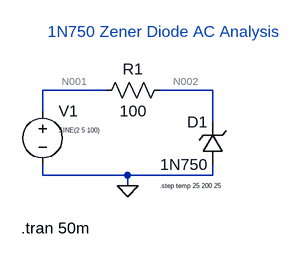
[diagram p0: schematic 1N750 Zener Diode AC Analysis.asc]
1N750 Zener Diode AC Analysis.asc, the LTspice schematic file:
Version 4
SHEET 1 1048 680
WIRE 48 80 -48 80
WIRE 208 80 128 80
WIRE -48 112 -48 80
WIRE 208 128 208 80
WIRE -48 208 -48 192
WIRE 80 208 -48 208
WIRE 208 208 208 192
WIRE 208 208 80 208
WIRE 80 224 80 208
FLAG 80 224 0
SYMBOL zener 224 192 R180
WINDOW 0 24 64 Left 2
WINDOW 3 24 0 Left 2
SYMATTR InstName D1
SYMATTR Value 1N750
SYMATTR Description Diode
SYMATTR Type diode
SYMBOL voltage -48 96 R0
WINDOW 123 0 0 Left 0
WINDOW 39 0 0 Left 0
WINDOW 3 24 44 Left 0
SYMATTR InstName V1
SYMATTR Value SINE(2 5 100)
SYMBOL res 144 64 R90
WINDOW 0 0 56 VBottom 2
WINDOW 3 32 56 VTop 2
SYMATTR InstName R1
SYMATTR Value 100
TEXT 128 224 Left 0 !.step temp 25 200 25
TEXT -40 -8 Left 2 ;1N750 Zener Diode AC Analysis
TEXT -80 288 Left 2 !.tran 50m

The netlist it stands for:
* 1N750 Zener Diode AC Analysis.asc
D1 0 N002 1N750
V1 N001 0 SINE(2 5 100)
R1 N002 N001 100
.model D D
.lib standard.dio
.step temp 25 200 25
* 1N750 Zener Diode AC Analysis
.tran 50m
.backanno
.end

* Results of the author's LTspice run, read from the files saved beside the schematic
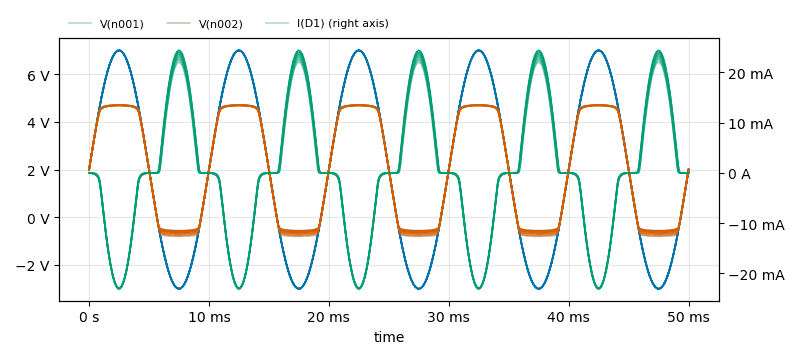
[diagram p1: Transient Analysis of 1N750 Zener Diode AC Analysis.asc, plotted from the saved traces]
* Transient Analysis, 8 runs:
*   V(n001) [temp=25°C]: min -2.999 V, max 6.999 V, average 2 V, rms 4.061 V, last 2 V
*   V(n001) [temp=50°C]: min -3 V, max 7 V, average 2 V, rms 4.061 V, last 2 V
*   V(n001) [temp=75°C]: min -3 V, max 6.999 V, average 2 V, rms 4.061 V, last 2 V
*   V(n001) [temp=100°C]: min -3 V, max 6.999 V, average 2 V, rms 4.061 V, last 2 V
*   V(n001) [temp=125°C]: min -2.999 V, max 7 V, average 2 V, rms 4.061 V, last 2 V
*   V(n001) [temp=150°C]: min -3 V, max 7 V, average 2 V, rms 4.061 V, last 2 V
*   V(n001) [temp=175°C]: min -2.999 V, max 6.997 V, average 2 V, rms 4.061 V, last 2 V
*   V(n001) [temp=200°C]: min -3 V, max 6.997 V, average 2 V, rms 4.061 V, last 2 V
*   V(n002) [temp=25°C]: min -803 mV, max 4.707 V, average 1.962 V, rms 3.081 V, last 2 V
*   V(n002) [temp=50°C]: min -770.4 mV, max 4.705 V, average 1.97 V, rms 3.075 V, last 2 V
*   V(n002) [temp=75°C]: min -737.2 mV, max 4.703 V, average 1.979 V, rms 3.07 V, last 1.999 V
*   V(n002) [temp=100°C]: min -703.5 mV, max 4.7 V, average 1.989 V, rms 3.065 V, last 1.999 V
*   V(n002) [temp=125°C]: min -669.4 mV, max 4.698 V, average 1.998 V, rms 3.06 V, last 1.999 V
*   V(n002) [temp=150°C]: min -634.7 mV, max 4.696 V, average 2.008 V, rms 3.054 V, last 1.998 V
*   V(n002) [temp=175°C]: min -599.6 mV, max 4.693 V, average 2.018 V, rms 3.049 V, last 1.997 V
*   V(n002) [temp=200°C]: min -564.1 mV, max 4.691 V, average 2.028 V, rms 3.044 V, last 1.995 V
*   I(D1) [temp=25°C]: min -22.9 mA, max 21.95 mA, average -383.2 µA, rms 12.92 mA, last -2.044 µA
*   I(D1) [temp=50°C]: min -22.94 mA, max 22.28 mA, average -295.2 µA, rms 13.05 mA, last -3.332 µA
*   I(D1) [temp=75°C]: min -22.95 mA, max 22.62 mA, average -204.6 µA, rms 13.18 mA, last -5.228 µA
*   I(D1) [temp=100°C]: min -22.98 mA, max 22.95 mA, average -111.2 µA, rms 13.32 mA, last -7.907 µA
*   I(D1) [temp=125°C]: min -23 mA, max 23.29 mA, average -15.59 µA, rms 13.46 mA, last -11.84 µA
*   I(D1) [temp=150°C]: min -23.03 mA, max 23.64 mA, average 82.33 µA, rms 13.6 mA, last -18.05 µA
*   I(D1) [temp=175°C]: min -23.02 mA, max 23.98 mA, average 181.7 µA, rms 13.75 mA, last -28.6 µA
*   I(D1) [temp=200°C]: min -23.05 mA, max 24.35 mA, average 280.9 µA, rms 13.9 mA, last -47.9 µA